# Altium schematic sheet Power_Supply.SchDoc
size A4; SheetNumber: 1; SheetTotal: 8
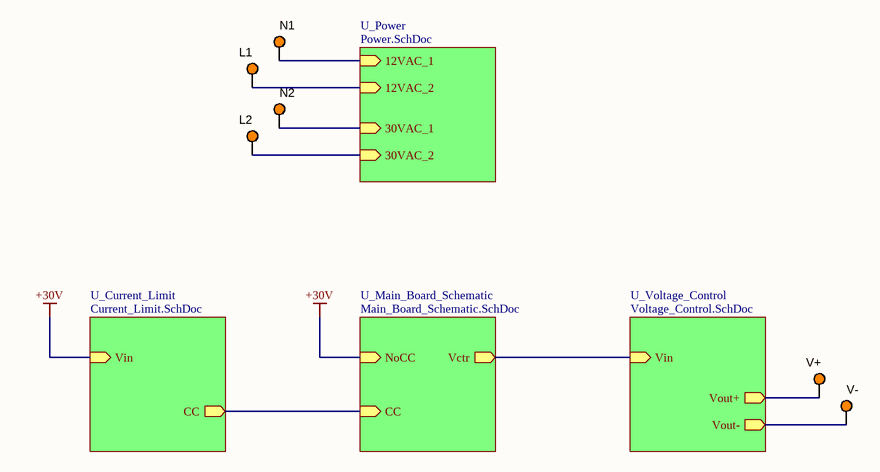
[diagram p0: Power_Supply.SchDoc]

## Parts
L1  5003  [KSTN-5003]  (value not drawn)
L2  5003  [KSTN-5003]  (value not drawn)
N1  5003  [KSTN-5003]  (value not drawn)
N2  5003  [KSTN-5003]  (value not drawn)
V+  5003  [KSTN-5003]  (value not drawn)
V-  5003  [KSTN-5003]  (value not drawn)

## Sub-sheets
U_Current_Limit = Current_Limit.SchDoc: Vin (in), CC (out)
U_Main_Board_Schematic = Main_Board_Schematic.SchDoc: Vctr (out), NoCC (in), CC (in)
U_Power = Power.SchDoc: 12VAC_1 (in), 12VAC_2 (in), 30VAC_1 (in), 30VAC_2 (in)
U_Voltage_Control = Voltage_Control.SchDoc: Vin (in), Vout+ (out), Vout- (out)

## Nets
+30V: sheet U_Main_Board_Schematic/NoCC, sheet U_Current_Limit/Vin
NetL1_1: L1.1 ; sheet U_Power/12VAC_2
NetL2_1: L2.1 ; sheet U_Power/30VAC_2
NetN1_1: N1.1 ; sheet U_Power/12VAC_1
NetN2_1: N2.1 ; sheet U_Power/30VAC_1
NetV+_1: V+.1 ; sheet U_Voltage_Control/Vout+
NetV-_1: V-.1 ; sheet U_Voltage_Control/Vout-
(unnamed): sheet U_Main_Board_Schematic/Vctr, sheet U_Voltage_Control/Vin
(unnamed): sheet U_Main_Board_Schematic/CC, sheet U_Current_Limit/CC

## Library data of the parts
L1 L2 N1 N2 V+ V- = CMP-002-00037-2: Test Point, Orange, Height 4.6 mm, Tail Length 3 mm, 1-Pin THD, RoHS; Manufacturer: Keystone; Colour: Orange; Packaging: Bulk; Package Description: 1-Pin Through Hole Device, Dia 2.54 mm; Pins: 1; Package Reference: 5003; Datasheet Version: Jun-15; Case/Package: 5003; Mounting Technology: TH; Connector Type: TestPoint; Diameter: 2.54mm; Contact Material: Bronze; Datasheet URL: http://keyelco.com/userAssets/file/M65p56.pdf; Manufacturer URL: http://www.keyelco.com/; Package Quantity: 10; Contact Plating: Tin; RoHS Compliant: True